# Altium schematic sheet uCCtrl.SchDoc
size B
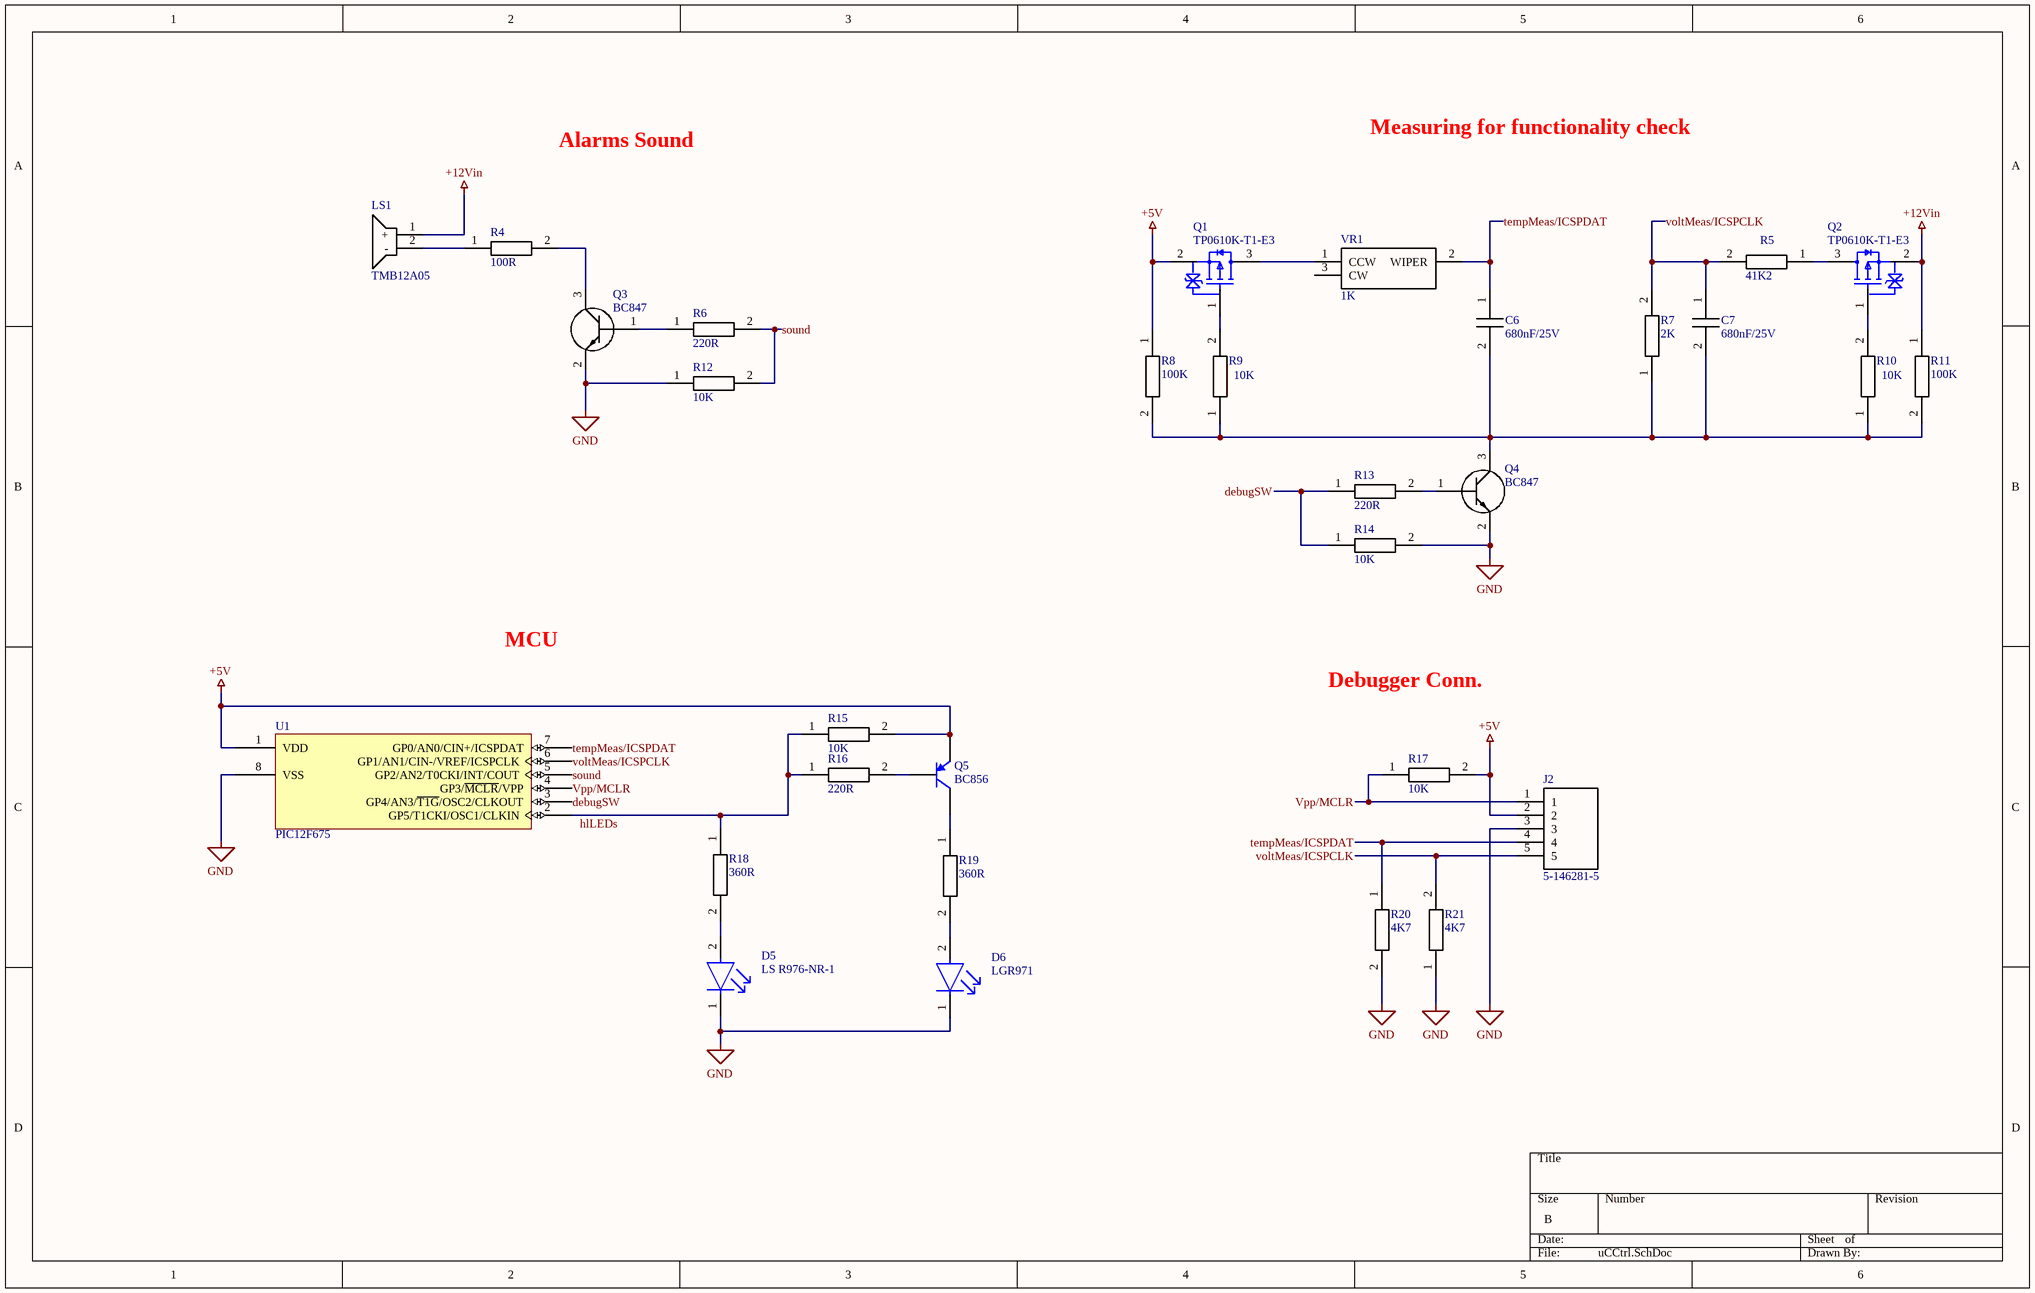
[diagram p0: uCCtrl.SchDoc]

## Parts
C6  680nF/25V  [CAPC2012X95N]
C7  680nF/25V  [CAPC2012X95N]
D5  LS R976-NR-1  [FP-LS_R976-MFG]
D6  LGR971  [FP-LG_R971-MFG]
J2  5-146281-5  [HDRV5W67P0X254_1X5_1229X234X821P]
LS1  TMB12A05  [TMB12A05]
Q1  TP0610K-T1-E3  [FP-S-03946-MFG]
Q2  TP0610K-T1-E3  [FP-S-03946-MFG]
Q3  BC847  [BC847215]
Q4  BC847  [BC847215]
Q5  BC856  [NXP-SOT23-3_V]
R4  100R  [RESC2012X60N]
R5  41K2  [RESC2012X65N]
R6  220R  [RESC2012X65N]
R7  2K  [RESC2012X65N]
R8  100K  [RESC2012X65N]
R9  10K  [RESC2012X65N]
R10  10K  [RESC2012X65N]
R11  100K  [RESC2012X65N]
R12  10K  [RESC2012X65N]
R13  220R  [RESC2012X65N]
R14  10K  [RESC2012X65N]
R15  10K  [RESC2012X65N]
R16  220R  [RESC2012X65N]
R17  10K  [RESC2012X65N]
R18  360R  [RESC2012X65N]
R19  360R  [RESC2012X65N]
R20  4K7  [RESC2012X65N]
R21  4K7  [RESC2012X65N]
U1  PIC12F675  [PDIP300-P8]
VR1  1K  [23SR1KLFTR]

## Nets
+5V: J2.2 Q1.2(S) Q5.2(E) R8.1 R15.2 R17.2 U1.1(VDD)
+12Vin: LS1.1(+) Q2.2(S) R11.1
GND: D5.1(C) D6.1(C) J2.3 Q3.2(E) Q4.2(E) R12.1 R14.2 R20.2 R21.1 U1.8(VSS)
debugSW: R13.1 R14.1 U1.3(GP4/AN3/~{T1G}/OSC2/CLKOUT)
hlLEDs: R15.1 R16.1 R18.1 U1.2(GP5/T1CKI/OSC1/CLKIN)
sound: R6.2 R12.2 U1.5(GP2/AN2/T0CKI/INT/COUT)
tempMeas/ICSPDAT: C6.1 J2.4 R20.1 U1.7(GP0/AN0/CIN+/ICSPDAT) VR1.2(WIPER)
voltMeas/ICSPCLK: C7.1 J2.5 R5.2 R7.2 R21.2 U1.6(GP1/AN1/CIN-/VREF/ICSPCLK)
Vpp/MCLR: J2.1 R17.1 U1.4(GP3/~{MCLR}/VPP)
NetC6_2: C6.2 C7.2 Q4.3(C) R7.1 R8.2 R9.1 R10.1 R11.2
NetD5_2: D5.2(A) R18.2
NetD6_2: D6.2(A) R19.2
NetLS1_2: LS1.2(-) R4.1
NetQ1_1: Q1.1(G) R9.2
NetQ1_3: Q1.3(D) VR1.1(CCW)
NetQ2_1: Q2.1(G) R10.2
NetQ2_3: Q2.3(D) R5.1
NetQ3_1: Q3.1(B) R6.1
NetQ3_3: Q3.3(C) R4.2
NetQ4_1: Q4.1(B) R13.2
NetQ5_1: Q5.1(B) R16.2
NetQ5_3: Q5.3(C) R19.1

Not connected (* = marked no-connect by the designer): VR1 3(CW)

## Notes on the sheet
- Alarms Sound
- Measuring for functionality check
- MCU
- Debugger Conn.

## Library data of the parts
C6 C7 = GRM219B31E684KA88D: Capacitor; Manufacturer_Name: Murata Electronics; Datasheet Link: http://www.murata.com/~/media/webrenewal/support/library/catalog/products/capacitor/mlcc/c02e.pdf; Height: 0.95mm; Manufacturer_Part_Number: GRM219B31E684KA88D
D5 = CMP-62016-000037-1: LED RED DIFFUSED 0805 SMD; Lens Size: 1.25mm; Number of LEDs: 1; Luminous Intensity: 180mcd; Dominant Wavelength: 633nm; Lens Style: Flat; Reverse Voltage: 12V; Lens Color: White; Forward Voltage: 2.5V; Forward Current: 25mA; Power Dissipation: 65W; Luminous Flux: 0.47lm; Test Current: 20mA; Viewing Angle: 160°; Length: 2mm; Number of Pins: 2; Lens Transparency: Diffused; Min Operating Temperature: -30°C; Case Code (Metric): 2012; Depth: 1.35mm; Color: Red; Illumination Color: Red; Max Operating Temperature: 85°C; Mount: Surface Mount; Case/Package: 0805; Height: 0.9mm; Package Quantity: 16000; Number of Elements: 1; Radiation Hardening: No; Case Code (Imperial): 0805; Packaging: Tape and Reel; Width: 1.25mm
D6 = CMP-62016-000039-1: LED GREEN DIFFUSED 0805 SMD; Test Current: 20mA; Power Dissipation: 65mW; Number of LEDs: 1; Viewing Angle: 160°; Lens Color: White; Lens Size: 1.25mm; Forward Voltage: 2.2V; Reverse Voltage: 12V; Forward Current: 25mA; Luminous Intensity: 45mcd; Luminous Flux: 0.1lm; Dominant Wavelength: 570nm; Min Operating Temperature: -30°C; Packaging: Tape and Reel; Radiation Hardening: No; Number of Pins: 2; Case Code (Imperial): 0805; Lens Style: Diffused; Mount: Surface Mount; Package Quantity: 1; Case Code (Metric): 2012; Color: Green; Case/Package: 0805; Width: 1.25mm; Illumination Color: Green; Lens Transparency: Diffused; Max Operating Temperature: 85°C; Number of Elements: 1; Depth: 1.35mm; Height: 0.9mm; Length: 2.1mm
J2 = 5-146281-5: Connector; Manufacturer_Name: TE Connectivity; Datasheet Link: https://www.te.com/commerce/DocumentDelivery/DDEController?Action=showdoc&DocId=Customer+Drawing%7F146281%7FG2%7Fpdf%7FEnglish%7FENG_CD_146281_G2.pdf%7F5-146281-5; Height: 8.21mm; Manufacturer_Part_Number: 5-146281-5; Mouser Part Number: 571-5-146281-5; Mouser Price/Stock: https://www.mouser.co.uk/ProductDetail/TE-Connectivity/5-146281-5?qs=bwpFY26eRVcDY9brDBVAcw%3D%3D; Arrow Part Number: 5-146281-5; Arrow Price/Stock: https://www.arrow.com/en/products/5-146281-5/te-connectivity?region=nac
LS1 = TMB12A05: Loudspeaker or Buzzer; Manufacturer_Name: Jiangsu Huaneng Elec; Datasheet Link: https://datasheet.lcsc.com/szlcsc/Jiangsu-Huaneng-Elec-TMB12A05_C96093.pdf; Height: 9.5mm; Manufacturer_Part_Number: TMB12A05
Q1 Q2 = CMP-02550-000129-1: MOSFET P-CH 60V 185MA SOT23-3; Manufacturer: Vishay; Drain To Source Voltage: -60V; Depletion Mode: False; Max Junction Temp: +150°C; Threshold Vgs Max: -3V; Rthja Max: 350°C/W; Max Forward Diode Voltage: -1.4V; Gate Charge At Vgs: 1.7nC @ -15V; Power Dissipation: 350mW; Turn Off Delay Time: 35ns; Number Of P Channels: 1; Standoff Height: 0.01mm; Input Capacitace At Vds: 23pF @ -25V; Gate To Source Voltage: 20V; Turn On Delay Time: 20ns; Continuous Drain Current: -185mA; Drain To Source Resistance: 6Ω; Threshold Vgs Min: -1V; Pulse Drain Current: -800mA; Temperature: -55°C to +150°C; Digikey Description: MOSFET P-CH 60V 185MA SOT23-3; Drain To Source Breakdown Voltage: -60V; Category: Trans; Temperature Range High: +150°C; Ipc Land Pattern Name: SOT95P237X100-3; Height: 1.12mm; Temperature Range Low: -55°C; Device Class L3: MOSFETs; Manufacturer Part Number: TP0610K-T1-E3; Number Of Channels: 1; ComponentLink2Description: Datasheet; RoHS: TRUE; Lead Free: Yes; Package: S-03946; Mouser Description: Mosfet; P-ch; Vdss -60V; Rds(on) 10 Ohms; Id -185MA; TO-236 (SOT-23); Pd 350MW; -55DEGC; Automotive: No; Device Class L2: Transistors; Device Class L1: Discrete Semiconductors; Octopart: https://octopart.com/tp0610k-t1-e3-vishay-40944172; ComponentLink2URL: http://www.vishay.com/docs/71411/tp0610k.pdf
Q3 Q4 = BC847,215: Transistor BJT NPN; Manufacturer_Name: Nexperia; Datasheet Link: https://assets.nexperia.com/documents/data-sheet/BC847_SER.pdf; Height: 1.1mm; Manufacturer_Part_Number: BC847,215; Mouser Part Number: 771-BC847215; Mouser Price/Stock: https://www.mouser.co.uk/ProductDetail/Nexperia/BC847215?qs=me8TqzrmIYWROhdFmDauyQ%3D%3D; Arrow Part Number: BC847,215; Arrow Price/Stock: https://www.arrow.com/en/products/bc847215/nexperia?region=nac
Q5 = CMP-2000-05936-1: PNP General Purpose Transistor, 65 V, -65 to 150 degC, 3-Pin SOT23, RoHS; Manufacturer: NXP; No. of Pins: 3; Voltage Vcbo: 80V; Power Dissipation Ptot Max: 250mW; Current Ic hFE: 2mA; Collector Emitter Voltage V(br)ceo: 65V; Hfe Min: 125; Continuous Collector Current Ic Max: 100mA; Gain Bandwidth ft Typ: 150MHz; Transistor Case Style: SOT-23; No. of Transistors: 1; Package Version: 02/2016; SMD Marking: 3D; Gain Bandwidth ft Min: 100MHz; SVHC: NoSVHC(19-Dec-2012); Noise Factor Max: 10dB; Collector Emitter Voltage Vces: -300mV; Operating Temperature Range: -65°Cto+150°C; Datasheet URL: http://www.nxp.com/documents/data_sheet/BC856_BC857_BC858.pdf; Device Marking: BC856; Mounting Technology: SurfaceMount; Package Reference: SOT23-3; Operating Temperature Max: 150°C; Package / Case: SOT-23; DC Current Gain hFE: 125; Current Ic Continuous a Max: 100mA; Power Dissipation Pd: 250mW; Manufacturer URL: http://www.nxp.com/; Termination Type: SMD; Transistor Polarity: PNP; Package URL: http://www.nxp.com/documents/outline_drawing/SOT23.pdf; DC Collector Current: 100mA; Operating Temperature Min: -65°C; Package Description: 3-Pin Small Outline Transistor, Body 1.3 x 2.9 mm, Pitch 0.95 mm; Datasheet Version: 01/2004
R4 = CRCW0805100RFKEAHP: Resistor; Manufacturer_Name: Vishay; Datasheet Link: https://componentsearchengine.com/Datasheets/1/CRCW08051R00FKEAHP.pdf; Height: 0.6mm; Manufacturer_Part_Number: CRCW0805100RFKEAHP; Mouser Part Number: 71-CRCW0805100RFKEAH; Mouser Price/Stock: https://www.mouser.co.uk/ProductDetail/Vishay-Dale/CRCW0805100RFKEAHP?qs=k2%2FDWSARqgHN0DmoUSjg4g%3D%3D; Arrow Part Number: CRCW0805100RFKEAHP; Arrow Price/Stock: https://www.arrow.com/en/products/crcw0805100rfkeahp/vishay?region=nac
R5 = CPF0805B41K2E1: Resistor; Manufacturer_Name: TE Connectivity; Datasheet Link: http://docs-europe.electrocomponents.com/webdocs/13d1/0900766b813d116f.pdf; Height: 0.65mm; Manufacturer_Part_Number: CPF0805B41K2E1
R6 R12-R16 = CPF0805B220RE: Resistor; Manufacturer_Name: TE Connectivity; Datasheet Link: http://docs-europe.electrocomponents.com/webdocs/13d1/0900766b813d116f.pdf; Height: 0.65mm; Manufacturer_Part_Number: CPF0805B220RE
R7-R11 R17-R21 = CPF0805B360RE1: Resistor; Manufacturer_Name: TE Connectivity; Datasheet Link: http://docs-europe.electrocomponents.com/webdocs/13d1/0900766b813d116f.pdf; Height: 0.65mm; Manufacturer_Part_Number: CPF0805B360RE1; Mouser Part Number: 279-CPF0805B360RE1; Mouser Price/Stock: https://www.mouser.co.uk/ProductDetail/TE-Connectivity-Holsworthy/CPF0805B360RE1?qs=iJVBkmKXgrlAzfqD%252B6zqmg%3D%3D
U1 = CMP-0190-00021-1: FLASH-Based 8-Bit CMOS Microcontroller, 10-Bit A/D, 8-Pin PDIP, Industrial Temperature; Note1: Refer to data sheet (DS41190F) for details of supply voltage range under different conditions.; DatasheetVersion: revF, Sep-2009; Code_JEDEC: MS-001; PackageVersion: revBB, Aug-2009; PackageDescription: 8-Lead Plastic Dual In-Line (P) - 300 mil Body [PDIP]; PackageReference: PDIP300-P8
VR1 = 23SR1KLFTR: Variable Resistor; Manufacturer_Name: TT Electronics; Datasheet Link: https://www.mouser.com/datasheet/2/414/23-1527241.pdf; Height: 2.73mm; Manufacturer_Part_Number: 23SR1KLFTR